# Altium schematic sheet Vert_1.SchDoc
size A4; SheetNumber: 1; SheetTotal: 1
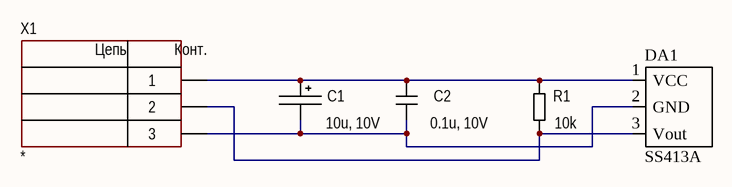
[diagram p0: Vert_1.SchDoc]

## Parts
C1  10u, 10V  [TANTAL_A]
C2  0.1u, 10V  [CH0603C]
DA1  SS413A
R1  10k  [CH0603R]
X1  *  [CON: WJ06-03P]

## Nets
NetC1_1: C1.1 C2.2 DA1.1(VCC) R1.2 X1.1
NetC1_2: C1.2 C2.1 DA1.2(GND) X1.3
NetDA1_3: DA1.3(Vout) R1.1 X1.2

## Notes on the sheet
- (in symbol 3-Connector) Цепь; Конт.

## Library data of the parts
C1 = TantalCap: Manufacturer: *; Model: *; HelpURL: *; ComponentKind: *; Value: *
C2 = Capacitor: Manufacturer: *; Model: *; HelpURL: *; ComponentKind: *; Value: *
R1 = Resistor: Manufacturer: *; Model: *; HelpURL: *; ComponentKind: *; Value: *
X1 = 3-Connector: Model: *; Manufacturer: *; HelpURL: *; ComponentKind: *